# Altium project CPLDSquareWaveGenerator.PrjPcb
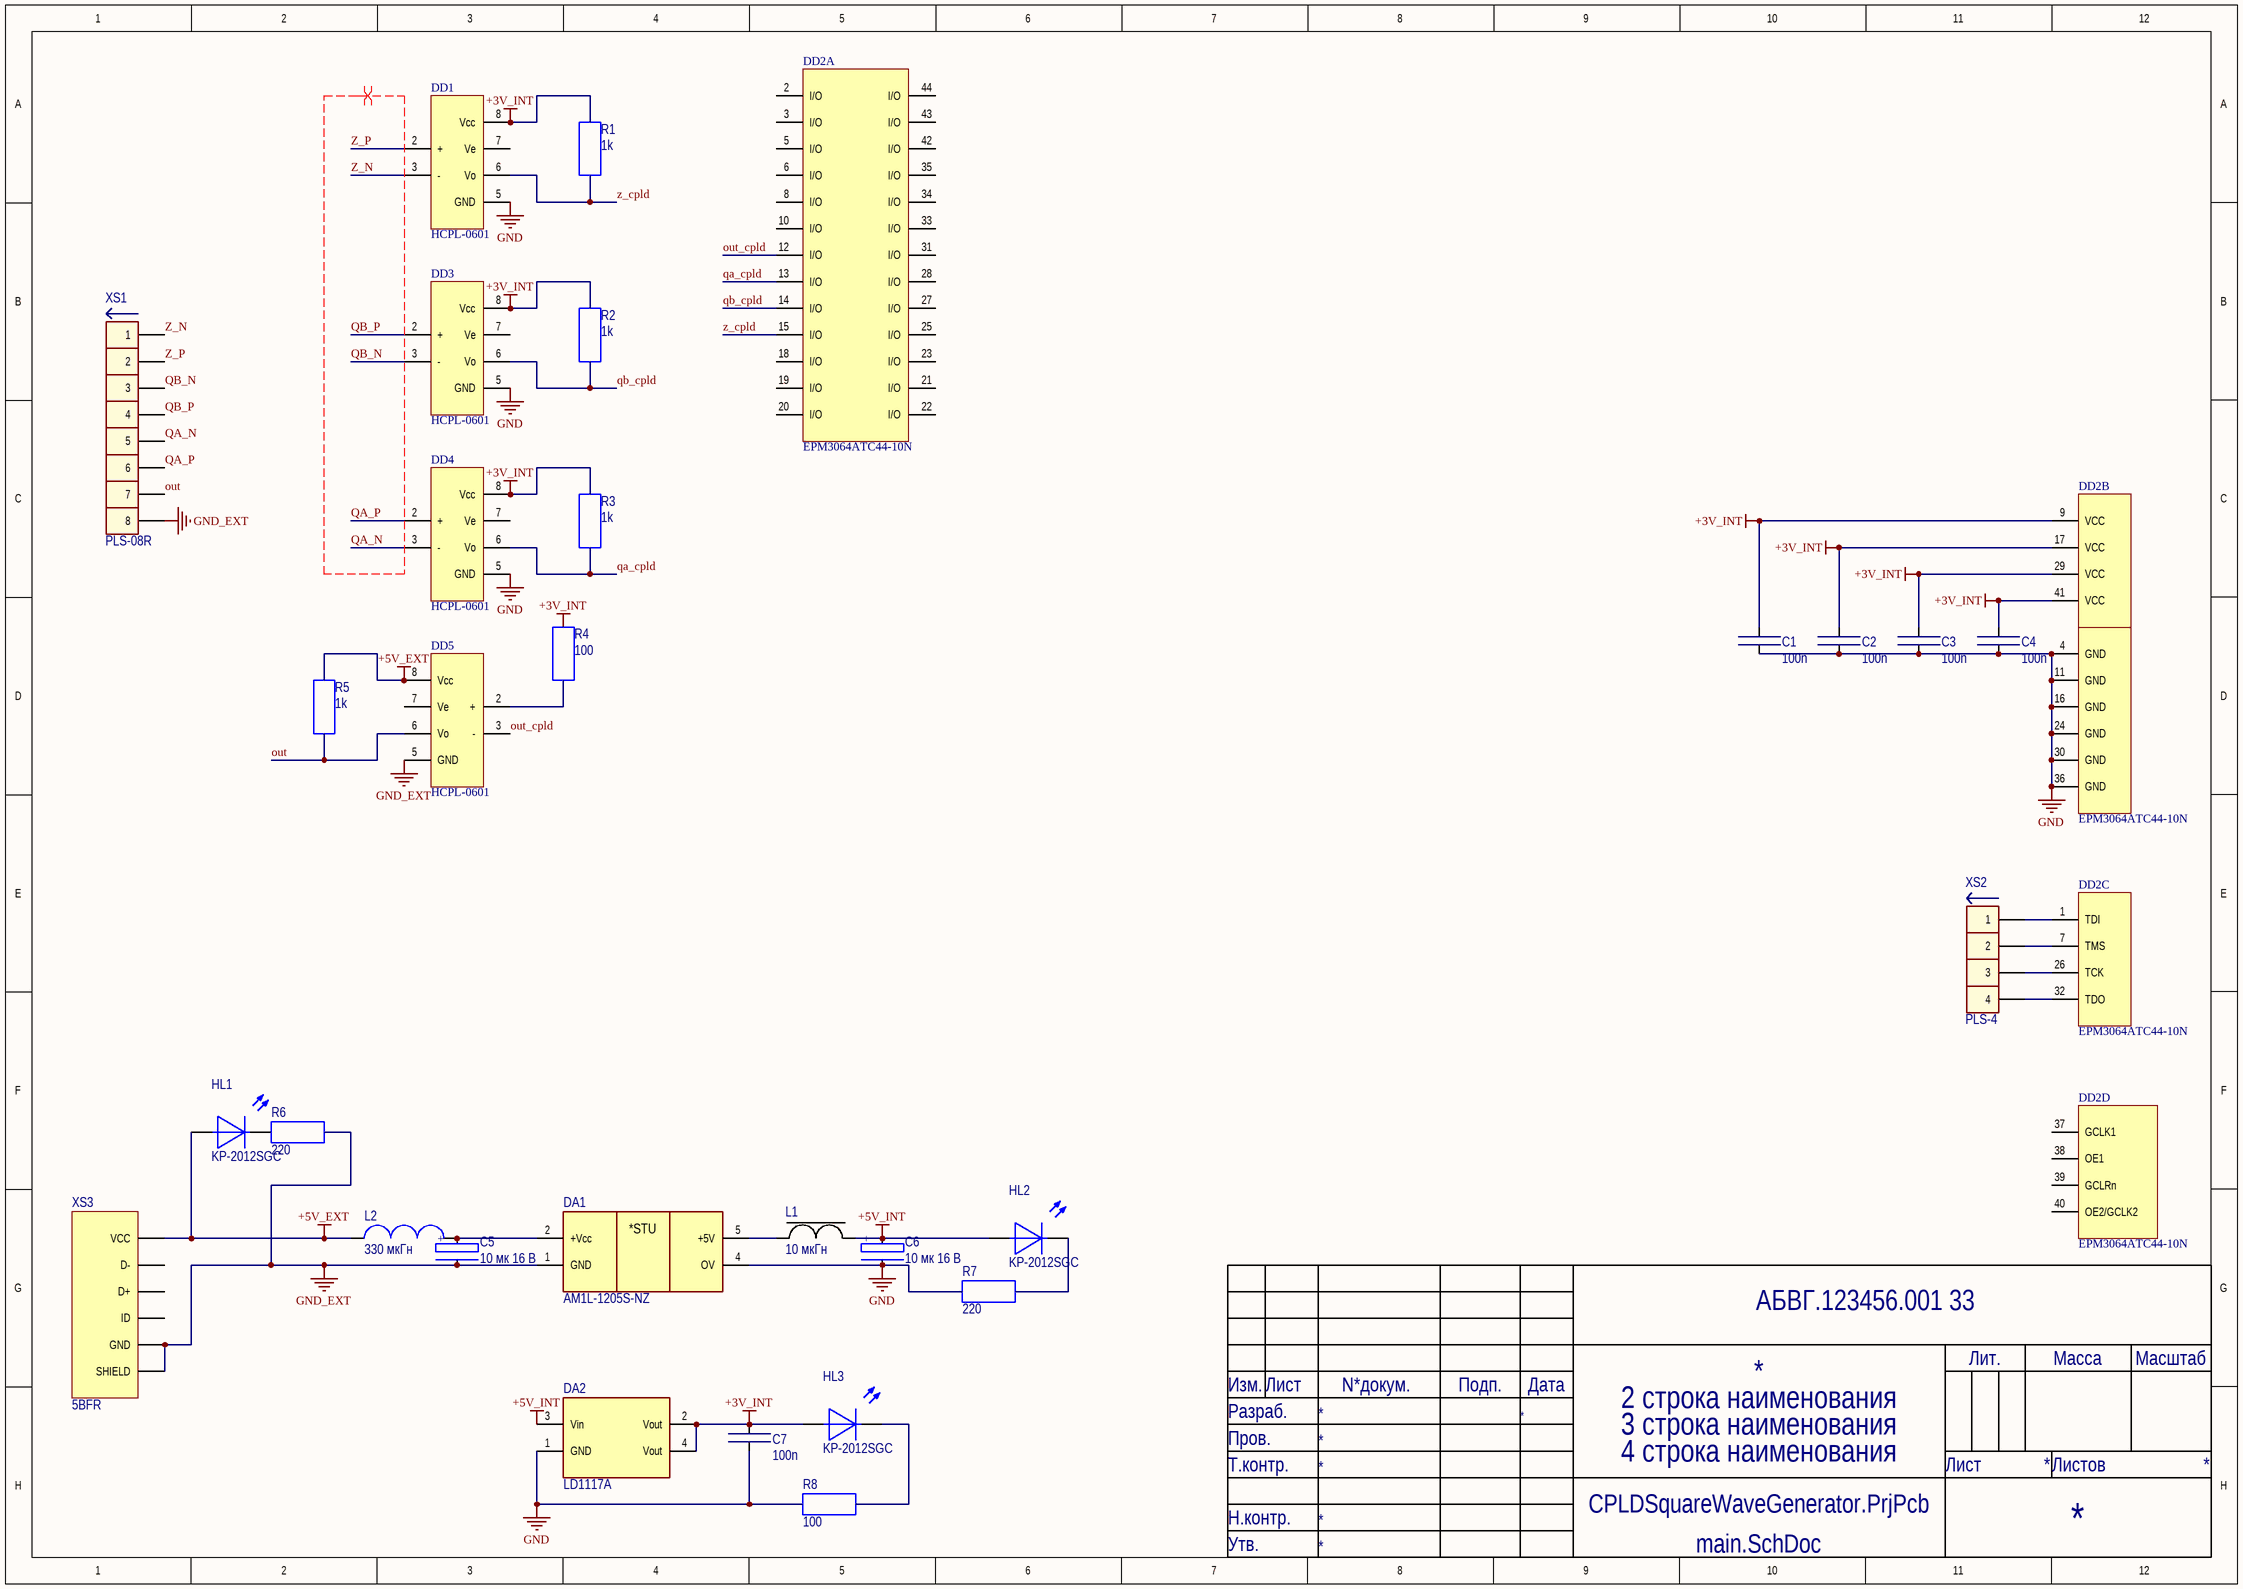
[diagram p0: main.SchDoc]
1 sheet, 30 parts. Net scope: global (net labels, ports and power ports of the same name join across sheets).
Board files: OSHparkMini.PcbDoc, OSHparkTemplate.PcbDoc, ltftemplate.PcbDoc, OSHpark_2Layers.PcbDoc

## Sheet main.SchDoc
size 420 x 297 mm; Title2str: 2 строка наименования; DecimalNumber: АБВГ.123456.001 33; Title3str: 3 строка наименования; Title4str: 4 строка наименования

### Parts
C1  100n  [SMDRC0603]
C2  100n  [SMDRC0603]
C3  100n  [SMDRC0603]
C4  100n  [SMDRC0603]
C5  10 мк 16 В  [CAP_POLAR_ELLYTE_B]
C6  10 мк 16 В  [CAP_POLAR_ELLYTE_B]
C7  100n  [SMDRC0603]
DA1  AM1L-1205S-NZ  [SOP254P1120X625-8M]
DA2  LD1117A  [SOT230P700X180-4L]
DD1  HCPL-0601  [HCPL-1601]
DD2  EPM3064ATC44-10N  [TQFP80P1200X1230X120-44N]  (parts A,B,C,D of 4)
DD3  HCPL-0601  [HCPL-1601]
DD4  HCPL-0601  [HCPL-1601]
DD5  HCPL-0601  [HCPL-1601]
HL1  KP-2012SGC  [DIOMELF2012M]
HL2  KP-2012SGC  [DIOMELF2012M]
HL3  KP-2012SGC  [DIOMELF2012M]
L1  10 мкГн  [MLZ2012]
L2  330 мкГн  [INDP7972X50M]
R1  1k  [SMDRC0603]
R2  1k  [SMDRC0603]
R3  1k  [SMDRC0603]
R4  100  [SMDRC0603]
R5  1k  [SMDRC0603]
R6  220  [SMDRC0603]
R7  220  [SMDRC0603]
R8  100  [SMDRC0603]
XS1  PLS-08R  [PLS-08R1]
XS2  PLS-4  [PLS-04]
XS3  5BFR  [USB2.0microB]

### Nets
+3V_INT: C1.2 C2.2 C3.2 C4.2 C7.2 DA2.2(Vout) DA2.4(Vout) DD1.8(Vcc) DD2.9(VCC) DD2.17(VCC) DD2.29(VCC) DD2.41(VCC) DD3.8(Vcc) DD4.8(Vcc) HL3.1 R1.2 R2.2 R3.2 R4.2
+5V_EXT: DD5.8(Vcc) HL1.1 L2.2 R5.2 XS3.VCC
+5V_INT: C6.2(+) DA2.3(Vin) HL2.1 L1.2
GND: C1.1 C2.1 C3.1 C4.1 C6.1(-) C7.1 DA1.4(OV) DA2.1(GND) DD1.5(GND) DD2.4(GND) DD2.11(GND) DD2.16(GND) DD2.24(GND) DD2.30(GND) DD2.36(GND) DD3.5(GND) DD4.5(GND) R7.2 R8.1
GND_EXT: C5.1(-) DA1.1(GND) DD5.5(GND) R6.1 XS1.8 XS3.GND XS3.SHIELD
out: DD5.6(Vo) R5.1 XS1.7
out_cpld: DD2.12(I/O) DD5.3(-)
qa_cpld: DD2.13(I/O) DD4.6(Vo) R3.1
QA_N: DD4.3(-) XS1.5
QA_P: DD4.2(+) XS1.6
qb_cpld: DD2.14(I/O) DD3.6(Vo) R2.1
QB_N: DD3.3(-) XS1.3
QB_P: DD3.2(+) XS1.4
z_cpld: DD1.6(Vo) DD2.15(I/O) R1.1
Z_N: DD1.3(-) XS1.1
Z_P: DD1.2(+) XS1.2
NetC5_2: C5.2(+) DA1.2(+Vcc) L2.1
NetDA1_5: DA1.5(+5V) L1.1
NetDD2_1: DD2.1(TDI) XS2.1
NetDD2_7: DD2.7(TMS) XS2.2
NetDD2_26: DD2.26(TCK) XS2.3
NetDD2_32: DD2.32(TDO) XS2.4
NetDD5_2: DD5.2(+) R4.1
NetHL1_2: HL1.2 R6.2
NetHL2_2: HL2.2 R7.1
NetHL3_2: HL3.2 R8.2

Not connected (* = marked no-connect by the designer): DD1 7(Ve); DD2 2(I/O) 3(I/O) 5(I/O) 6(I/O) 8(I/O) 10(I/O) 18(I/O) 19(I/O) 20(I/O) 21(I/O) 22(I/O) 23(I/O) 25(I/O) 27(I/O) 28(I/O) 31(I/O) 33(I/O) 34(I/O) 35(I/O) 37(GCLK1) 38(OE1) 39(GCLRn) 40(OE2/GCLK2) 42(I/O) 43(I/O) 44(I/O); DD3 7(Ve); DD4 7(Ve); DD5 7(Ve); XS3 D+ D- ID

### Layout directives
differential pair; net class QuadratureSignal: QA_N, QA_P, QB_N, QB_P, Z_N, Z_P

### Notes on the sheet
- Изм.
- Лист
- N*докум.
- Подп.
- Дата
- Лит.
- Масса
- Масштаб
- Разраб.
- Пров.
- Т.контр.
- Лиcт
- Лиcтов
- Н.контр.
- Утв.
- (in symbol AM1L-1205S-NZ) *STU

### Library data of the parts
C1-C4 C7 = Capacitor 0603 100n: Generic capasitor non-polar; PartNumber: Capacitor 0603 100n; Value: 100n; ComponentLink1Description: Datasheet; Package: 0603
C5 C6 = 10000_016: 10uF 16V Polar SMD cap; ManufacturerPartNumber: CA016M0010REB-0405; Manufacturer: YAGEO; Supplier: -; Price: 3,03; Package: штырьевой; ComponentLink1Description: Datasheet; ComponentLink2Description: Datasheet-local; Value: 10 мк 16 В; Price: Price; Note: *
DA1 = AM1L-1205S-NZ: DC/DC Isolation; Manufacturer: AIMTEC; ComponentLink1URL: http://www.aimtec.com/site/Aimtec/files/Datasheet/HighResolution/AM1L-N-Z.pdf; Package: SMD-8; Price: 166,68; Supplier: Диджитек; ComponentLink1Description: Datasheet; ManufacturerPartNumber: AM1L-1205S-NZ
DA2 = LD1117AS33TR: LDO регулятор напряжения 3.3V 1.0A Positive; Manufacturer: STMicroelectronics; ManufacturerPartNumber: LD1117AS33TR; ComponentLink1URL: http://www.mouser.com/ds/2/389/CD00002116-250310.pdf; ComponentLink1Description: http://www.mouser.com/ds/2/389/CD00002116-250310.pdf; Price: 45; Note: *; Supplier: *
DD1 DD3-DD5 = HCPL-0601-500E: OPTOISO 3.75KV OPN COLLECTOR 8SO; Manufacturer: Fairchild Semiconductor; Forward Voltage: 1.75V; Forward Current: 50mA; Propagation Delay: 75ns; Reverse Breakdown Voltage: 5V; Rise Time: 50ns; Number of Channels: 1; Max Power Dissipation: 85mW; Data Rate: 10Mbps; Fall Time: 12ns; Direction: Unidirectional; Input Current: 15mA; Max Output Voltage: 7V; Polarity: Inverting; Supplier 1: Mouser; ManufacturerPartNumber: HCPL-0601; Stock 1: 5013; Pricing 1: 1=2.35, 10=2, 100=1.6, 500=1.4, 1000=1.16, 3000=1.07, 6000=1.03, 9000=0.958 (USD); Mount: Surface Mount; Case/Package: SOIC; Number of Pins: 8; Weight: 0.252g; Min Operating Temperature: -40°C; Max Operating Temperature: 85°C; Output Current: 50mA; Packaging: Rail/Tube; Package Quantity: 3000; Output Current per Channel: 50mA; Number of Elements: 1; Power Dissipation: 85mW; Turn-On Delay Time: 75ns; Isolation Voltage: 3.75kV; Max Input Current: 15mA; Output Voltage: 7V; Max Output Current: 50mA; Reverse Voltage (DC): 5V; Length: 5.13mm; Height: 3.43mm; Width: 4.16mm; Radiation Hardening: No; Lead Free: Lead Free; REACH SVHC: No SVHC; ComponentLink1URL: https://datasheet.ciiva.com/4698/hcpl0601-185320-4698727.pdf; ComponentLink1Description: https://datasheet.ciiva.com/4698/hcpl0601-185320-4698727.pdf; ComponentLink2URL: https://datasheet.ciiva.com/11772/0900766b80d1f17b-11772100.pdf; ComponentLink2Description: https://datasheet.ciiva.com/11772/0900766b80d1f17b-11772100.pdf; ComponentLink3URL: https://datasheet.ciiva.com/26912/hcpl0601-26912362.pdf; ComponentLink3Description: https://datasheet.ciiva.com/26912/hcpl0601-26912362.pdf; ComponentLink4URL: https://datasheet.ciiva.com/2083/hcpl0611-2083487.pdf; ComponentLink4Description: https://datasheet.ciiva.com/2083/hcpl0611-2083487.pdf; ComponentLink5URL: https://datasheet.ciiva.com/26162/hcpl0611-26162959.pdf; ComponentLink5Description: https://datasheet.ciiva.com/26162/hcpl0611-26162959.pdf; ComponentLink6URL: https://datasheet.ciiva.com/26910/getdatasheetpartid-81668-26910220.pdf; ComponentLink6Description: https://datasheet.ciiva.com/26910/getdatasheetpartid-81668-26910220.pdf; ComponentLink7URL: https://datasheet.ciiva.com/8074/1796808-8074123.pdf; ComponentLink7Description: https://datasheet.ciiva.com/8074/1796808-8074123.pdf; ComponentLink8URL: https://datasheet.ciiva.com/8100/hcpl0611-8100123.pdf; ComponentLink8Description: https://datasheet.ciiva.com/8100/hcpl0611-8100123.pdf; Supplier Part Number 1: 512-HCPL0601
DD2 = EPM3064ATC44: MAX 3000A, 64 MACROCELLS; Manufacturer: Altera; Number of Gates: 1250; Min Supply Voltage: 3V; Max Supply Voltage: 3.6V; Propagation Delay: 10ns; Frequency: 125MHz; Operating Supply Voltage: 3.3V; Speed Grade: 10; Number of I/Os: 34; Number of Logic Blocks (LABs): 4; Number of Macrocells: 64; Memory Type: EEPROM; Max Frequency: 222.2MHz; Supplier 1: Digi-Key; ManufacturerPartNumber: EPM3064ATC44-10N; Stock 1: 1163; Pricing 1: 1=2.93 (USD); Mount: Surface Mount; Case/Package: TQFP; Number of Pins: 44; Min Operating Temperature: 0°C; Max Operating Temperature: 70°C; Package Quantity: 160; Packaging: Tray; Turn-On Delay Time: 10ns; Number of Logic Elements/Cells: 4; Number of Programmable I/O: 34; Termination: SMD/SMT; Number of Inputs: 34; Length: 10mm; Height: 0.95mm; Width: 10mm; Radiation Hardening: No; Lead Free: Lead Free; REACH SVHC: Unknown; ComponentLink1URL: https://datasheet.ciiva.com/1407/m3000a-1407040.pdf; ComponentLink1Description: https://datasheet.ciiva.com/1407/m3000a-1407040.pdf; ComponentLink2URL: https://datasheet.ciiva.com/1152/134639-1152985.pdf; ComponentLink2Description: https://datasheet.ciiva.com/1152/134639-1152985.pdf; ComponentLink3URL: https://datasheet.ciiva.com/25922/m3000a-25922153.pdf; ComponentLink3Description: https://datasheet.ciiva.com/25922/m3000a-25922153.pdf; ComponentLink4URL: https://datasheet.ciiva.com/5702/m3000a-5702171.pdf; ComponentLink4Description: https://datasheet.ciiva.com/5702/m3000a-5702171.pdf; ComponentLink5URL: https://datasheet.ciiva.com/1152/134639-1152983.pdf; ComponentLink5Description: https://datasheet.ciiva.com/1152/134639-1152983.pdf; ComponentLink6URL: https://datasheet.ciiva.com/1161/m3000a-1161336.pdf; ComponentLink6Description: https://datasheet.ciiva.com/1161/m3000a-1161336.pdf; ComponentLink7URL: https://datasheet.ciiva.com/5702/m3000a-5702168.pdf; ComponentLink7Description: https://datasheet.ciiva.com/5702/m3000a-5702168.pdf; Supplier Part Number 1: 544-1977-ND
HL1-HL3 = LED1_G: Diod LED SMD Green; ComponentLink1Description: Datasheet; Price: 2,88; ComponentLink2Description: Datasheet-local; ComponentLink2URL: *; Color: Green; ManufacturerPartNumber: KP-2012SGC
L1 = MLZ2012N100LT: Катушка 500mA 10мкГн; ManufacturerPartNumber: MPZ1608S181A; Manufacturer: TDK; ComponentLink1Description: Datasheet; ComponentLink1URL: http://www.mouser.com/ds/2/400/inductor_commercial_decoupling_mlz_en-348849.pdf; Package: 2012; Supplier: Промэлектроника; ComponentLink2Description: Datasheet-local; ComponentLink2URL: *; Value: 10 мкГн
L2 = SCD0705T-331K-N: Inductor; ManufacturerPartNumber: SCD0705T-331K-N; ComponentLink1Description: Datasheet; ComponentLink1URL: http://download.siliconexpert.com/pdfs/2010/12/8/6/47/4/732/yageo_/manual/inductors_smdpower_scd_2010.pdf; ComponentLink2Description: Datasheet-local; ComponentLink2URL: *; Value: 330 мкГн
R1-R3 R5 = Resistor 0603 1k: Generic resistor; PartNumber: Resistor 0603 1k; Value: 1k; ComponentLink1URL: http://www.mouser.com/ds/2/447/PYu-RC0402_51_RoHS_L_6_r-8721.pdf; ComponentLink1Description: Datasheet; Package: 0603
R4 R8 = Resistor 0603 100: Generic resistor; PartNumber: Resistor 0603 100; Value: 100; ComponentLink1URL: http://www.mouser.com/ds/2/447/PYu-RC0402_51_RoHS_L_6_r-8721.pdf; ComponentLink1Description: Datasheet; Package: 0603
R6 R7 = Resistor 0603 220: Generic resistor; PartNumber: Resistor 0603 220; Value: 220; ComponentLink1URL: http://www.mouser.com/ds/2/447/PYu-RC0402_51_RoHS_L_6_r-8721.pdf; ComponentLink1Description: Datasheet; Package: 0603
XS1 = Con8_M PLS-08MR: Male 8-pin connection; ManufacturerPartNumber: partnumber; ManufacturerPartNumber: PLS-08R; ComponentLink1Description: Datasheet; ComponentLink1URL: http://www.promelec.ru/catalog/406/1218/1223/1/99528/; ComponentLink2Description: Datasheet-local; ComponentLink2URL: *; Price: 1
XS2 = Con4_M_PLS-4: Male 4-pin connection; ManufacturerPartNumber: PLS-4; ComponentLink1Description: Datasheet; ComponentLink1URL: http://www.promelec.ru/catalog/406/1218/1224/1/24233/; ComponentLink2Description: Datasheet-local; ComponentLink2URL: *; Price: 1
XS3 = USB2.0-microB 5BFR: Роезтка microUSB угловая; ManufacturerPartNumber: microUSB 5BFR; Manufacturer: ?; Price: 29.91; Note: 5BFR; Supplier: *